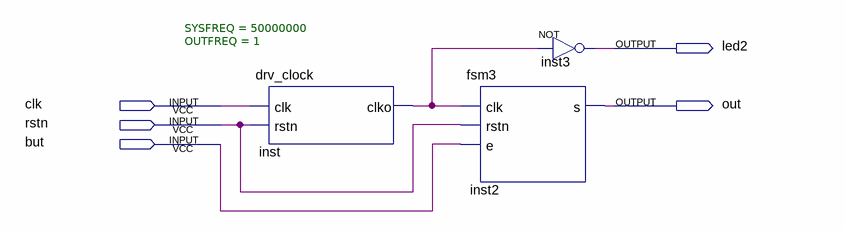
[diagram p0: schematic sheet]
// Quartus schematic dig2lab3.bdf as structural Verilog: 3 symbols, 5 pins
module dig2lab3 (
  input  clk,
  input  rstn,
  input  but,
  output led2,
  output out
);

  wire inst_clko;

  drv_clock #(.SYSFREQ(50000000), .OUTFREQ(1)) inst (.clk(clk), .rstn(rstn), .clko(inst_clko));
  fsm3 inst2 (.clk(inst_clko), .rstn(rstn), .e(but), .s(out));
  not inst3 (led2, inst_clko);
endmodule
